# Altium project Sfarm.PrjPcb (part 1 of 2)
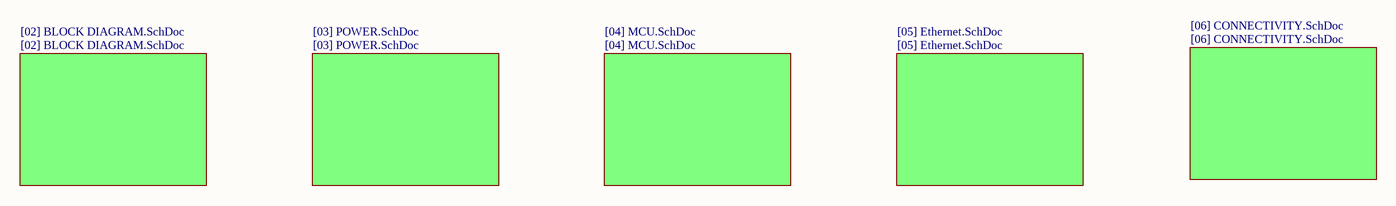
[diagram p0: SFarm.SchDoc]

6 sheets, 125 parts. Net scope: flat (ports and power ports of the same name join across sheets).
Board file: SFarmGW.PcbDoc
Sheets:
  SFarm.SchDoc
    [02] BLOCK DIAGRAM.SchDoc = [02] BLOCK DIAGRAM.SchDoc
    [03] POWER.SchDoc = [03] POWER.SchDoc
    [04] MCU.SchDoc = [04] MCU.SchDoc
    [05] Ethernet.SchDoc = [05] Ethernet.SchDoc
    [06] CONNECTIVITY.SchDoc = [06] CONNECTIVITY.SchDoc

## Sheet SFarm.SchDoc
size A3; Organization: Altium Limited; Address1: L3, 12a Rodborough Rd; Address2: Frenchs Forest; Address3: NSW; Address4: Australia 2086

### Sub-sheets
[02] BLOCK DIAGRAM.SchDoc = [02] BLOCK DIAGRAM.SchDoc: no entries
[03] POWER.SchDoc = [03] POWER.SchDoc: no entries
[04] MCU.SchDoc = [04] MCU.SchDoc: no entries
[05] Ethernet.SchDoc = [05] Ethernet.SchDoc: no entries
[06] CONNECTIVITY.SchDoc = [06] CONNECTIVITY.SchDoc: no entries

## Sheet [02] BLOCK DIAGRAM.SchDoc
size A3; Organization: Altium Limited; Address1: L3, 12a Rodborough Rd; Address2: Frenchs Forest; Address3: NSW; Address4: Australia 2086
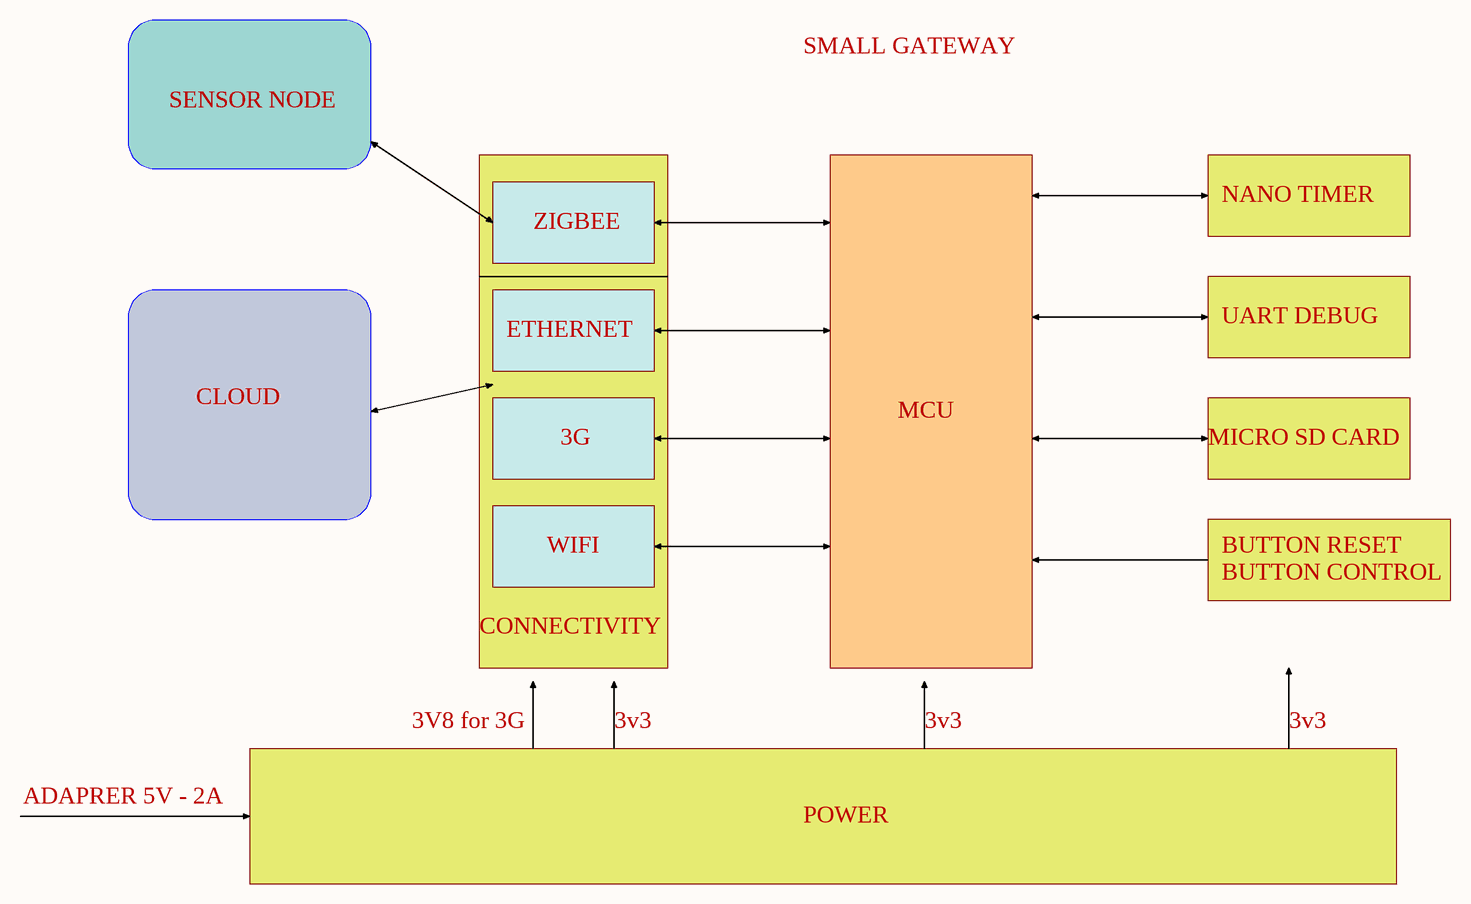
[diagram p1: [02] BLOCK DIAGRAM.SchDoc]

### Notes on the sheet
- SMALL GATEWAY
- SENSOR NODE
- NANO TIMER
- ZIGBEE
- ETHERNET
- UART DEBUG
- CLOUD
- MCU
- 3G
- MICRO SD CARD
- WIFI
- BUTTON RESET
- BUTTON CONTROL
- CONNECTIVITY
- 3V8 for 3G
- 3v3
- ADAPRER 5V - 2A
- POWER

## Sheet [03] POWER.SchDoc
size A3; Organization: Altium Limited; Address1: L3, 12a Rodborough Rd; Address2: Frenchs Forest; Address3: NSW; Address4: Australia 2086
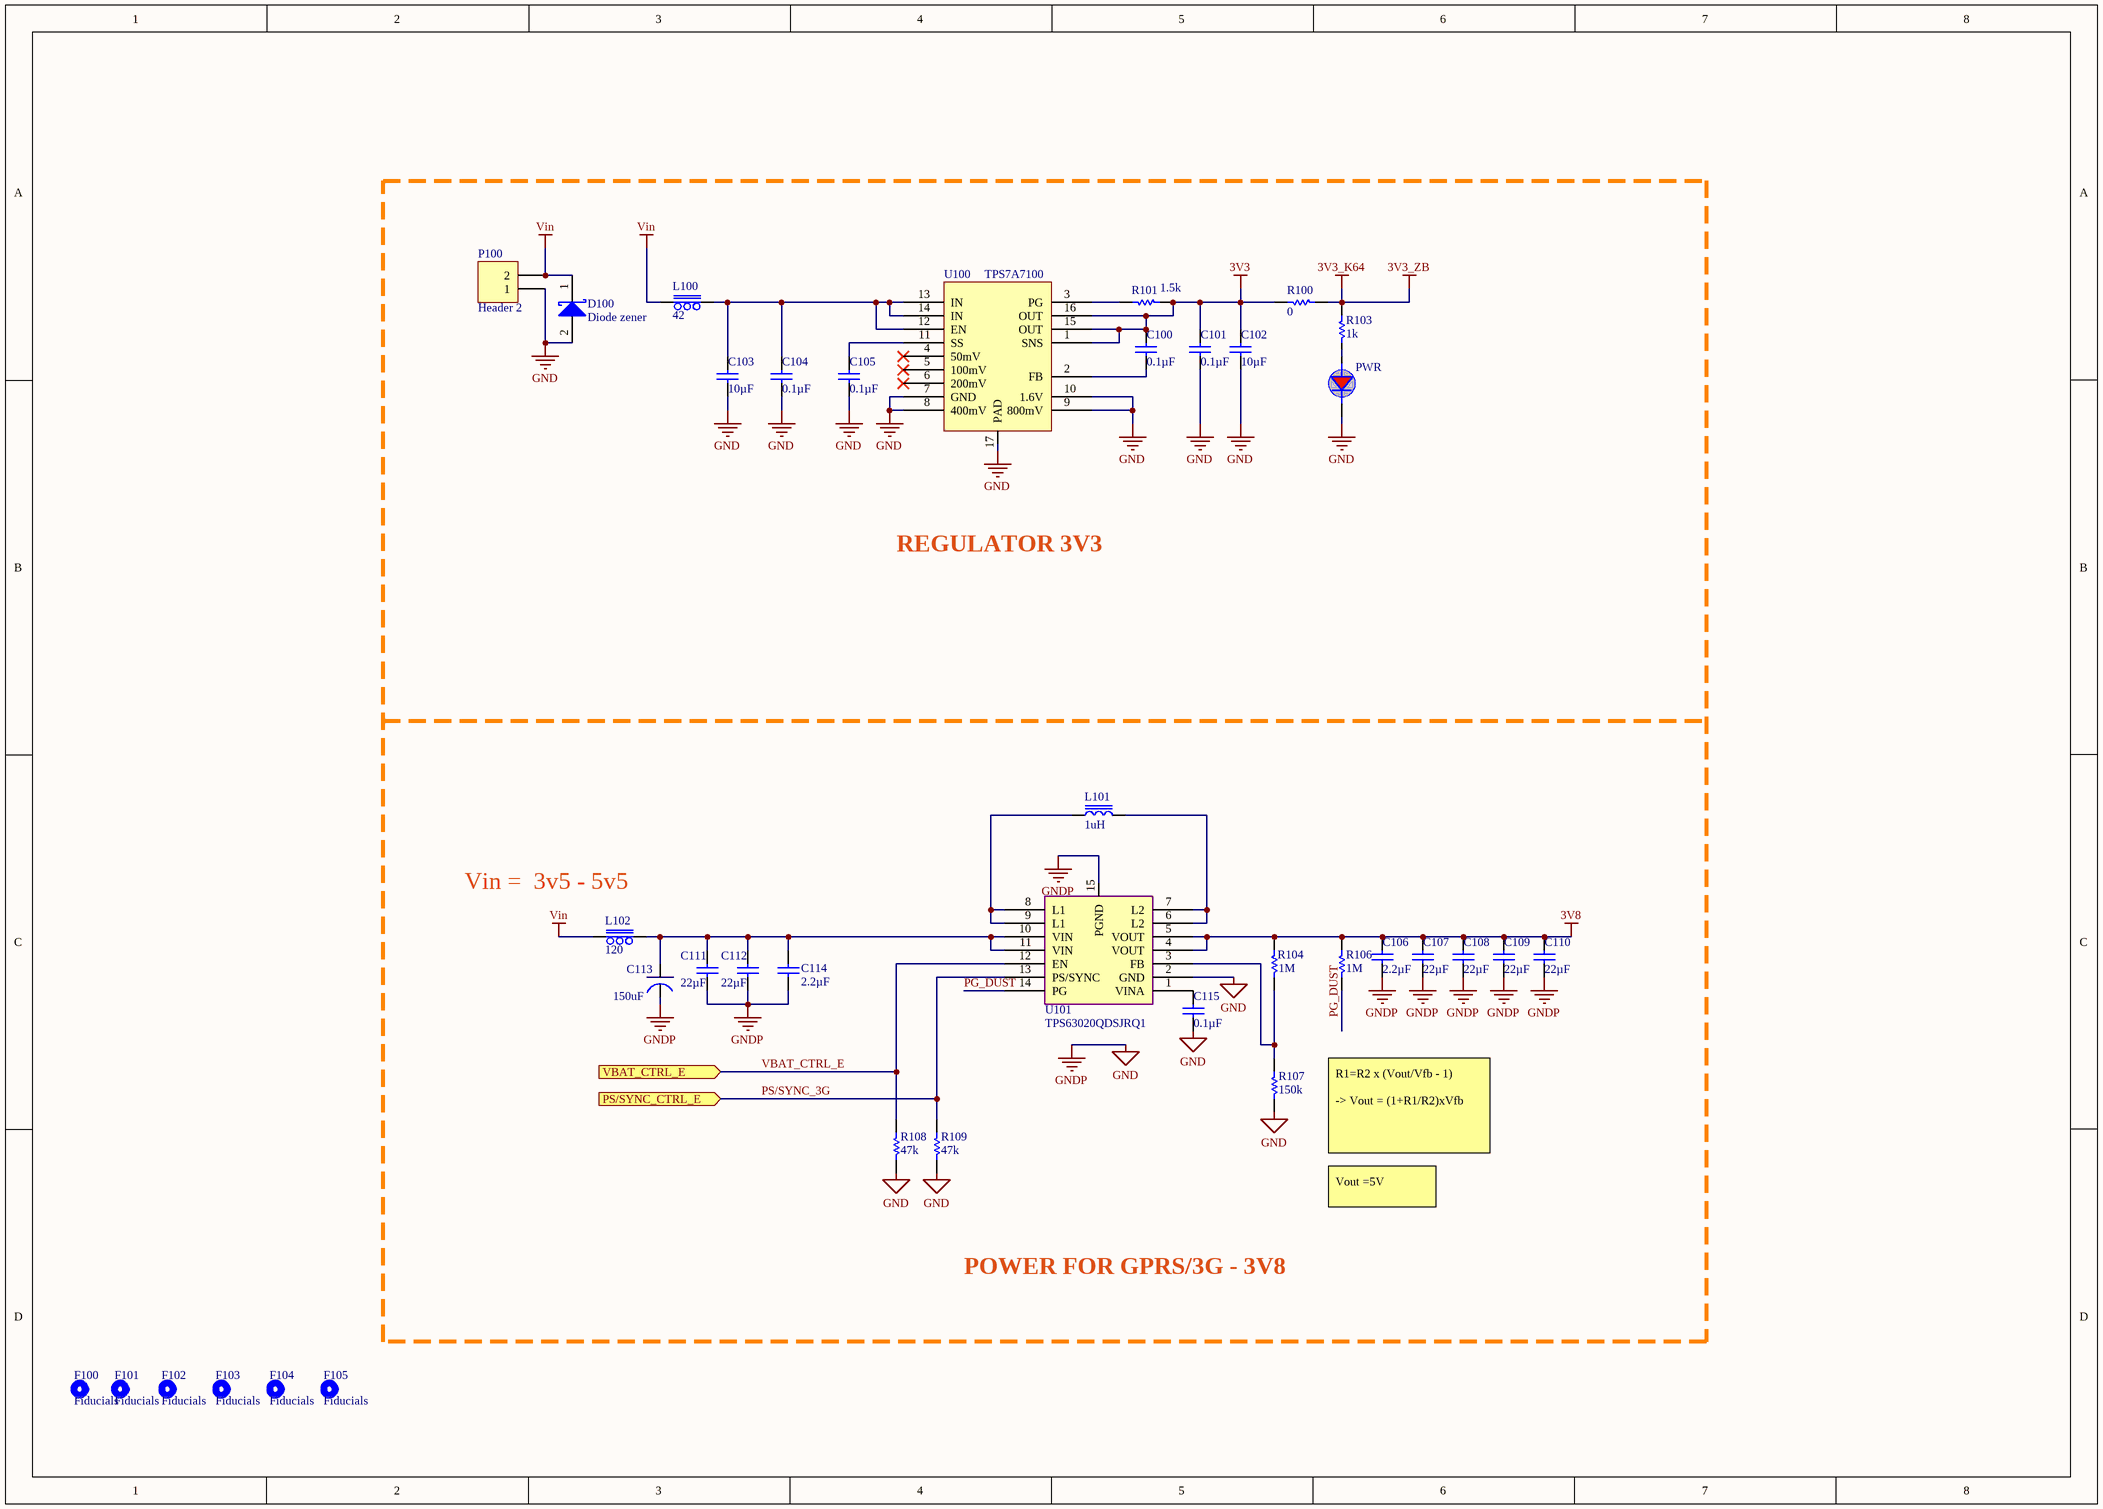
[diagram p2: [03] POWER.SchDoc]

### Parts
C100  0.1µF  [0402C]
C101  0.1µF  [0402C]
C102  10µF  [0805 cap]
C103  10µF  [0805 cap]
C104  0.1µF  [0402C]
C105  0.1µF  [0402C]
C106  2.2µF  [0402C]
C107  22µF  [0805 cap]
C108  22µF  [0805 cap]
C109  22µF  [0805 cap]
C110  22µF  [0805 cap]
C111  22µF  [0805 cap]
C112  22µF  [0805 cap]
C113  150uF  [CAPD7343]
C114  2.2µF  [0402C]
C115  0.1µF  [0402C]
D100  Diode zener  [SMA-diode]
F100  Fiducials  [fiducials]
F101  Fiducials  [fiducials]
F102  Fiducials  [fiducials]
F103  Fiducials  [fiducials]
F104  Fiducials  [fiducials]
F105  Fiducials  [fiducials]
L100  42  [0805F]
L101  1uH  [INDC4040X20N]
L102  120  [0805F]
P100  Header 2  [HED2]
PWR  (no value)  [0603LED-RED]
R100  0  [0805 Resistor]
R101  1.5k  [0603R]
R103  1k  [0603R]
R104  1M  [0402R]
R106  1M  [0603R]
R107  150k  [0402R]
R108  47k  [0603R]
R109  47k  [0603R]
U100  TPS7A7100  [QFN16]
U101  TPS63020QDSJRQ1  [VSON14]

### Ports
PS/SYNC_CTRL_E (in), VBAT_CTRL_E (in)

### Nets
3V3: C100.2 C101.2 C102.2 R100.1 R101.2 U100.1(SNS) U100.15(OUT) U100.16(OUT)
3V3_K64: R100.2 R103.2  [also labelled 3V3_ZB]
3V8: C106.2 C107.2 C108.2 C109.2 C110.2 R104.2 R106.2 U101.4(VOUT) U101.5(VOUT)
GND: C101.1 C102.1 C103.1 C104.1 C105.1 C106.1 C107.1 C108.1 C109.1 C110.1 C111.1 C112.1 C113.2 C114.1 C115.1 D100.2(A) P100.1 PWR.2(Katot) R107.1 R108.1 R109.1 U100.7(GND) U100.8(400mV) U100.9(800mV) U100.10(1.6V) U100.17(PAD) U101.2(GND) U101.15(PGND)  [also labelled GNDP]
Vin: D100.1(K) L100.1 L102.1 P100.2
PG_DUST: R106.1 U101.14(PG)
PS/SYNC_3G: R109.2 U101.13(PS/SYNC) ; port PS/SYNC_CTRL_E
VBAT_CTRL_E: R108.2 U101.12(EN) ; port VBAT_CTRL_E
NetC100_1: C100.1 U100.2(FB)
NetC103_2: C103.2 C104.2 L100.2 U100.12(EN) U100.13(IN) U100.14(IN)
NetC105_2: C105.2 U100.11(SS)
NetC111_2: C111.2 C112.2 C113.1 C114.2 L102.2 U101.10(VIN) U101.11(VIN)
NetC115_2: C115.2 U101.1(VINA)
NetL101_1: L101.1 U101.8(L1) U101.9(L1)
NetL101_2: L101.2 U101.6(L2) U101.7(L2)
NetPWR_1: PWR.1(anot) R103.1
NetR101_1: R101.1 U100.3(PG)
NetR104_1: R104.1 R107.2 U101.3(FB)

Not connected (* = marked no-connect by the designer): U100 4(50mV)* 5(100mV)* 6(200mV)*

### Notes on the sheet
- REGULATOR 3V3
- (near L102) Vin =  3v5 - 5v5
- R1=R2 x (Vout/Vfb - 1)
  -> Vout = (1+R1/R2)xVfb
- Vout =5V
- POWER FOR GPRS/3G - 3V8

### Library data of the parts
C100 C101 C104 C105 C115 = CAP0.1u0402: CAP CER 0.1UF 10V X7R 0402; Manufacturer: Taiyo Yuden; Manufacturer Part Number: LMK105B7104KVHF; Tolerance: ±10%; Supplier 1: Digi-Key; RoHS: RoHS Compliant; Category: Capacitors; Stock 1: 23930; Pricing 1: 1=0.1, 10=0.05, 100=0.0223, 500=0.01594, 1000=0.01252, 2500=0.01138, 5000=0.01047 (USD); Packaging: Cut Tape (CT); Part Status: Active; Capacitance: 0.1µF; Voltage - Rated: 10V; Temperature Coefficient: X7R; Operating Temperature: -55°C ~ 125°C; Features: -; Ratings: AEC-Q200; Applications: Automotive; Mounting Type: Surface Mount, MLCC; Package / Case: 0402 (1005 Metric); Size / Dimension: 0.039" L x 0.020" W (1.00mm x 0.50mm); Height - Seated (Max): -; Thickness (Max): 0.022" (0.55mm); Lead Spacing: -; Lead Style: -; ComponentLink1URL: http://www.yuden.co.jp/productdata/catalog/en/mlcc_all_hq_e.pdf; ComponentLink1Description: http://www.yuden.co.jp/productdata/catalog/en/mlcc_all_hq_e.pdf; Supplier Part Number 1: 587-3769-1-ND
C102 C103 = cap10u0805: CAP CER 10UF 16V X7R 0805; Manufacturer: Taiyo Yuden; Manufacturer Part Number: EMK212BB7106MG-T; Tolerance: ±20%; Supplier 1: Digi-Key; RoHS: RoHS Compliant; Category: Capacitors; Stock 1: 221600; Pricing 1: 1=0.51, 10=0.351, 100=0.2106, 500=0.15798, 1000=0.1334 (USD); Packaging: Cut Tape (CT); Part Status: Active; Capacitance: 10µF; Voltage - Rated: 16V; Temperature Coefficient: X7R; Operating Temperature: -55°C ~ 125°C; Features: -; Ratings: -; Applications: General Purpose; Mounting Type: Surface Mount, MLCC; Package / Case: 0805 (2012 Metric); Size / Dimension: 0.079" L x 0.049" W (2.00mm x 1.25mm); Height - Seated (Max): -; Thickness (Max): 0.053" (1.35mm); Lead Spacing: -; Lead Style: -; ComponentLink1URL: http://www.yuden.co.jp/productdata/catalog/en/mlcc06_e.pdf; ComponentLink1Description: http://www.yuden.co.jp/productdata/catalog/en/mlcc06_e.pdf; Supplier Part Number 1: 587-3319-1-ND
C106 C114 = cap2.2u0402: CAP CER 2.2UF 16V X5R 0402; Manufacturer: Taiyo Yuden; Manufacturer Part Number: EMK105ABJ225MV-F; Tolerance: ±20%; Supplier 1: Digi-Key; RoHS: RoHS Compliant; Category: Capacitors; Stock 1: 43595; Pricing 1: 1=0.27, 10=0.187, 100=0.1062, 500=0.07498, 1000=0.0656, 2500=0.06248, 5000=0.05779 (USD); Packaging: Cut Tape (CT); Part Status: Active; Capacitance: 2.2µF; Voltage - Rated: 16V; Temperature Coefficient: X5R; Operating Temperature: -55°C ~ 85°C; Features: -; Ratings: -; Applications: General Purpose; Mounting Type: Surface Mount, MLCC; Package / Case: 0402 (1005 Metric); Size / Dimension: 0.039" L x 0.020" W (1.00mm x 0.50mm); Height - Seated (Max): -; Thickness (Max): 0.022" (0.55mm); Lead Spacing: -; Lead Style: -; ComponentLink1URL: http://ds.yuden.co.jp/TYCOMPAS/ut/detail.do?productNo=EMK105ABJ225MV-F&fileName=EMK105ABJ225MV-F_SS&mode=specSheetDownload; ComponentLink1Description: http://ds.yuden.co.jp/TYCOMPAS/ut/detail.do?productNo=EMK105ABJ225MV-F&fileName=EMK105ABJ225MV-F_SS&mode=specSheetDownload; Supplier Part Number 1: 587-3302-1-ND
C107-C112 = cap22u0805: CAP CER 22UF 16V X5R 0805; Manufacturer: Taiyo Yuden; Manufacturer Part Number: EMK212BBJ226MG-T; Tolerance: ±20%; Supplier 1: Digi-Key; RoHS: RoHS Compliant; Category: Capacitors; Stock 1: 427128; Pricing 1: 1=0.55, 10=0.389, 100=0.2562, 500=0.18976, 1000=0.16129 (USD); Packaging: Cut Tape (CT); Part Status: Active; Capacitance: 22µF; Voltage - Rated: 16V; Temperature Coefficient: X5R; Operating Temperature: -55°C ~ 85°C; Features: -; Ratings: -; Applications: General Purpose; Mounting Type: Surface Mount, MLCC; Package / Case: 0805 (2012 Metric); Size / Dimension: 0.079" L x 0.039" W (2.00mm x 1.00mm); Height - Seated (Max): -; Thickness (Max): 0.049" (1.25mm); Lead Spacing: -; Lead Style: -; ComponentLink1URL: http://ds.yuden.co.jp/TYCOMPAS/ut/detail.do?productNo=EMK212BBJ226MG-T&fileName=EMK212BBJ226MG-T_SS&mode=specSheetDownload; ComponentLink1Description: http://ds.yuden.co.jp/TYCOMPAS/ut/detail.do?productNo=EMK212BBJ226MG-T&fileName=EMK212BBJ226MG-T_SS&mode=specSheetDownload; Supplier Part Number 1: 587-3239-1-ND
C113 = CAPTan150u7343: CAP TANT 150UF 10V 10% 2917; Manufacturer: AVX Corporation; Manufacturer Part Number: TPSD157K010R0085; Manufacturer Size Code: D; Type: Molded; ESR (Equivalent Series Resistance): 85 mOhm; Supplier 1: Digi-Key; Supplier Part Number 1: 478-9158-1-ND; RoHS: RoHS Compliant; Category: Capacitors; Stock 1: 1344; Pricing 1: 1=1.8, 10=1.419, 100=1.0639 (USD); Packaging: Cut Tape (CT); Part Status: Active; Tolerance: ±10%; Operating Temperature: -55°C ~ 125°C; Lifetime @ Temp.: -; Mounting Type: Surface Mount; Package / Case: 2917 (7343 Metric); Size / Dimension: 0.287" L x 0.169" W (7.30mm x 4.30mm); Height - Seated (Max): 0.122" (3.10mm); Lead Spacing: -; Features: General Purpose; Failure Rate: -; ComponentLink1URL: http://datasheets.avx.com/TPS.pdf; ComponentLink1Description: http://datasheets.avx.com/TPS.pdf
L100 = Ferrite Bead: FERRITE BEAD 42 OHM 0805 1LN; Manufacturer: Taiyo Yuden; Manufacturer Part Number: FBMJ2125HS420-TV; Filter Type: Power Line; Number of Lines: 1; Impedance @ Frequency: 42 Ohm @ 100MHz; Current Rating (Max): 4A; DC Resistance (DCR) (Max): 8 mOhm; Supplier 1: Digi-Key; Supplier Part Number 1: 587-3851-6-ND; RoHS: RoHS Compliant; Category: Filters; Stock 1: 2013; Pricing 1: 1=0.2, 10=0.154, 25=0.1276, 50=0.11, 100=0.099, 250=0.0836, 500=0.0748, 1000=0.0638 (USD); Packaging: Digi-Reel®; Part Status: Active; Ratings: AEC-Q200; Operating Temperature: -40°C ~ 125°C; Package / Case: 0805 (2012 Metric); Mounting Type: Surface Mount; Height (Max): 0.041" (1.05mm); Size / Dimension: 0.079" L x 0.049" W (2.00mm x 1.25mm); ComponentLink1URL: http://ds.yuden.co.jp/TYCOMPAS/ut/detail.do?productNo=FBMJ2125HS420-TV&fileName=FBMJ2125HS420-TV_SS&mode=specSheetDownload; ComponentLink1Description: http://ds.yuden.co.jp/TYCOMPAS/ut/detail.do?productNo=FBMJ2125HS420-TV&fileName=FBMJ2125HS420-TV_SS&mode=specSheetDownload
L101 = Inductor: Fixed Inductors XFL4020 Low DCR Ind 1 uH 20% 11 A Compos; Manufacturer: Coilcraft; Manufacturer Part Number: XFL4020-102MEB; Part # Aliases: XFL4020-102MEC; Case Height: 2.1 mm; Case Length: 4.3 mm; Core Material: Composite; Maximum DC Current: 11 A; Maximum DC Resistance: 11.9 mOhms; Self Resonant Frequency: 64 MHz; Shielding: Shielded; Test Frequency: 100 kHz; Supplier 1: Mouser; Supplier Part Number 1: 994-XFL4020-102MEB; Inductance: 1 uH; Dimensions: 4.3 mm W x 4.3 mm L x 2.1 mm H; Case Width: 4.3 mm; RoHS: Details; Operating Temperature Range: - 40 C to + 125 C; Packaging: Cut Tape; Product: Power Inductors; Tolerance: 20 %; Termination Style: SMD/SMT; Series: XFL4020; ComponentLink1URL: https://datasheet.ciiva.com/13167/xfl4020-13167357.pdf; ComponentLink1Description: https://datasheet.ciiva.com/13167/xfl4020-13167357.pdf
L102 = Ferrite Bead: Manufacturer: MURATA; Manufacturer Part Number: BLM18PG121SN1D; Ferrite Case Style: 0603 [1608 Metric]; Product Range: BLM18; DC Current Rating: 2; DC Resistance Max: 0.05; Impedance Tolerance: 25%; Supplier 1: Newark; RoHS: YES; Stock 1: 28827; Pricing 1: 1=0.039, 50=0.036, 100=0.029, 500=0.026, 1000=0.023, 2500=0.022, 5000=0.02, 10000=0.019 (USD); Automotive Qualifications Standard: -; Packaging: Each; ComponentLink1URL: http://www.farnell.com/datasheets/1740433.pdf; ComponentLink1Description: http://www.farnell.com/datasheets/1740433.pdf; ComponentLink2URL: http://www.farnell.com/datasheets/5148.pdf; ComponentLink2Description: http://www.farnell.com/datasheets/5148.pdf; Supplier Part Number 1: 73M9109
P100 = Header 2: Header, 2-Pin; LatestRevisionDate: 17-Jul-2002; LatestRevisionNote: Re-released for DXP Platform.; Publisher: Altium Limited
PWR = LedRed0603: LED RED CLEAR 0603 SMD; Manufacturer: Everlight Electronics Co Ltd; Manufacturer Part Number: QTLP600C7TR; Lens Color: Colorless; Millicandela Rating: 20mcd; Lens Style/Size: Rectangle with Flat Top, 1.20mm x 0.80mm; Voltage - Forward (Vf) (Typ): 1.9V; Current - Test: 20mA; Viewing Angle: 100°; Wavelength - Dominant: 645nm; Wavelength - Peak: 660nm; Supplier 1: Digi-Key; RoHS: RoHS Compliant; Category: Optoelectronics; Stock 1: 19325; Pricing 1: 1=0.41, 10=0.297, 25=0.2276, 100=0.1485, 250=0.10892, 500=0.0924, 1000=0.0759 (USD); Packaging: Cut Tape (CT); Part Status: Active; Color: Red; Lens Transparency: Clear; Mounting Type: Surface Mount; Features: -; Package / Case: 0603 (1608 Metric); Size / Dimension: 1.60mm L x 0.80mm W; Height (Max): 0.80mm; ComponentLink1URL: http://media.digikey.com/pdf/Data%20Sheets/Everlight%20PDFs/QTLP600C.pdf; ComponentLink1Description: http://media.digikey.com/pdf/Data%20Sheets/Everlight%20PDFs/QTLP600C.pdf; Supplier Part Number 1: 1080-1400-1-ND
R100 = RES00805: RES SMD 0.0 OHM JUMPER 1/8W 0805; Manufacturer: Panasonic Electronic Components; Manufacturer Part Number: ERJ-6GEY0R00V; Resistance (Ohms): 0.0; Power (Watts): 0.125W, 1/8W; Supplier 1: Digi-Key; RoHS: RoHS Compliant; Category: Resistors; Stock 1: 562130; Pricing 1: 1=0.1, 10=0.024, 25=0.0172, 50=0.0132, 100=0.0097, 250=0.00744, 500=0.00594, 1000=0.00437 (USD); Packaging: Cut Tape (CT); Part Status: Active; Tolerance: Jumper; Composition: Thick Film; Features: Automotive AEC-Q200; Temperature Coefficient: -; Operating Temperature: -55°C ~ 155°C; Package / Case: 0805 (2012 Metric); Supplier Device Package: 0805; Size / Dimension: 0.079" L x 0.049" W (2.00mm x 1.25mm); Height - Seated (Max): 0.028" (0.70mm); Failure Rate: -; ComponentLink1URL: http://industrial.panasonic.com/www-cgi/jvcr13pz.cgi?E+PZ+3+AOA0001+ERJ6GEY0R00V+7+WW; ComponentLink1Description: http://industrial.panasonic.com/www-cgi/jvcr13pz.cgi?E+PZ+3+AOA0001+ERJ6GEY0R00V+7+WW; Supplier Part Number 1: P0.0ACT-ND
R101 = RES1k50603: RES SMD 1.5K OHM 1% 1/10W 0603; Manufacturer: Panasonic Electronic Components; Manufacturer Part Number: ERJ-3EKF1501V; Power (Watts): 0.1W, 1/10W; Temperature Coefficient: ±100ppm/°C; Supplier 1: Digi-Key; RoHS: RoHS Compliant; Category: Resistors; Stock 1: 0; Pricing 1: 1=0.1, 10=0.021, 100=0.0087, 1000=0.00389, 2500=0.00338 (USD); Packaging: Cut Tape (CT); Part Status: Active; Resistance (Ohms): 1.5k; Tolerance: ±1%; Composition: Thick Film; Features: Automotive AEC-Q200; Operating Temperature: -55°C ~ 155°C; Package / Case: 0603 (1608 Metric); Supplier Device Package: 0603; Size / Dimension: 0.063" L x 0.031" W (1.60mm x 0.80mm); Height - Seated (Max): 0.022" (0.55mm); Failure Rate: -; ComponentLink1URL: https://industrial.panasonic.com/cdbs/www-data/pdf/RDA0000/AOA0000C298.pdf; ComponentLink1Description: https://industrial.panasonic.com/cdbs/www-data/pdf/RDA0000/AOA0000C298.pdf; Supplier Part Number 1: P1.50KHCT-ND
R103 = RES1k0603: RES SMD 1K OHM 1% 1/10W 0603; Manufacturer: Panasonic Electronic Components; Manufacturer Part Number: ERJ-3EKF1001V; Power (Watts): 0.1W, 1/10W; Temperature Coefficient: ±100ppm/°C; Supplier 1: Digi-Key; RoHS: RoHS Compliant; Category: Resistors; Stock 1: 0; Pricing 1: 1=0.1, 10=0.021, 100=0.0087, 1000=0.00389, 2500=0.00338 (USD); Packaging: Digi-Reel®; Part Status: Active; Resistance (Ohms): 1k; Tolerance: ±1%; Composition: Thick Film; Features: Automotive AEC-Q200; Operating Temperature: -55°C ~ 155°C; Package / Case: 0603 (1608 Metric); Supplier Device Package: 0603; Size / Dimension: 0.063" L x 0.031" W (1.60mm x 0.80mm); Height - Seated (Max): 0.022" (0.55mm); Failure Rate: -; ComponentLink1URL: https://industrial.panasonic.com/cdbs/www-data/pdf/RDA0000/AOA0000C298.pdf; ComponentLink1Description: https://industrial.panasonic.com/cdbs/www-data/pdf/RDA0000/AOA0000C298.pdf; Supplier Part Number 1: P1.00KHDKR-ND
R104 = RES1M0402: RES SMD 1M OHM 1% 1/10W 0402; Manufacturer: Panasonic Electronic Components; Manufacturer Part Number: ERJ-2RKF1004X; Power (Watts): 0.1W, 1/10W; Temperature Coefficient: ±100ppm/°C; Supplier 1: Digi-Key; RoHS: RoHS Compliant; Category: Resistors; Stock 1: 0; Pricing 1: 1=0.1, 10=0.028, 100=0.0113, 1000=0.00509, 2500=0.00442, 5000=0.00365 (USD); Packaging: Cut Tape (CT); Part Status: Active; Resistance (Ohms): 1M; Tolerance: ±1%; Composition: Thick Film; Features: Automotive AEC-Q200; Operating Temperature: -55°C ~ 155°C; Package / Case: 0402 (1005 Metric); Supplier Device Package: 0402; Size / Dimension: 0.039" L x 0.020" W (1.00mm x 0.50mm); Height - Seated (Max): 0.016" (0.40mm); Failure Rate: -; ComponentLink1URL: https://industrial.panasonic.com/cdbs/www-data/pdf/RDA0000/AOA0000C298.pdf; ComponentLink1Description: https://industrial.panasonic.com/cdbs/www-data/pdf/RDA0000/AOA0000C298.pdf; Supplier Part Number 1: P1.00MLCT-ND
R106 = RES1M0603: RES SMD 1M OHM 1% 1/10W 0603; Manufacturer: Panasonic Electronic Components; Manufacturer Part Number: ERJ-3EKF1004V; Power (Watts): 0.1W, 1/10W; Temperature Coefficient: ±100ppm/°C; Supplier 1: Digi-Key; RoHS: RoHS Compliant; Category: Resistors; Stock 1: 0; Pricing 1: 1=0.1, 10=0.021, 100=0.0087, 1000=0.00389, 2500=0.00338 (USD); Packaging: Cut Tape (CT); Part Status: Active; Resistance (Ohms): 1M; Tolerance: ±1%; Composition: Thick Film; Features: Automotive AEC-Q200; Operating Temperature: -55°C ~ 155°C; Package / Case: 0603 (1608 Metric); Supplier Device Package: 0603; Size / Dimension: 0.063" L x 0.031" W (1.60mm x 0.80mm); Height - Seated (Max): 0.022" (0.55mm); Failure Rate: -; ComponentLink1URL: https://industrial.panasonic.com/cdbs/www-data/pdf/RDA0000/AOA0000C298.pdf; ComponentLink1Description: https://industrial.panasonic.com/cdbs/www-data/pdf/RDA0000/AOA0000C298.pdf; Supplier Part Number 1: P1.00MHCT-ND
R107 = Resistor: RES SMD 150K OHM 1% 1/10W 0402; Manufacturer: Panasonic Electronic Components; Manufacturer Part Number: ERJ-2RKF1503X; Power (Watts): 0.1W, 1/10W; Temperature Coefficient: ±100ppm/°C; Supplier 1: Digi-Key; Supplier Part Number 1: P150KLCT-ND; RoHS: RoHS Compliant; Category: Resistors; Stock 1: 0; Pricing 1: 1=0.1, 10=0.028, 100=0.0113, 1000=0.00509, 2500=0.00442, 5000=0.00365 (USD); Packaging: Cut Tape (CT); Part Status: Active; Resistance (Ohms): 150k; Tolerance: ±1%; Composition: Thick Film; Features: Automotive AEC-Q200; Operating Temperature: -55°C ~ 155°C; Package / Case: 0402 (1005 Metric); Supplier Device Package: 0402; Size / Dimension: 0.039" L x 0.020" W (1.00mm x 0.50mm); Height - Seated (Max): 0.016" (0.40mm); Failure Rate: -; ComponentLink1URL: https://industrial.panasonic.com/cdbs/www-data/pdf/RDA0000/AOA0000C298.pdf; ComponentLink1Description: https://industrial.panasonic.com/cdbs/www-data/pdf/RDA0000/AOA0000C298.pdf
R108 R109 = RES47k0603: RES SMD 47K OHM 1% 1/10W 0603; Manufacturer: Panasonic Electronic Components; Manufacturer Part Number: ERJ-3EKF4702V; Power (Watts): 0.1W, 1/10W; Temperature Coefficient: ±100ppm/°C; Supplier 1: Digi-Key; RoHS: RoHS Compliant; Category: Resistors; Stock 1: 2205285; Pricing 1: 1=0.1, 10=0.021, 100=0.0087, 1000=0.00389, 2500=0.00338 (USD); Packaging: Cut Tape (CT); Part Status: Active; Resistance (Ohms): 47k; Tolerance: ±1%; Composition: Thick Film; Features: Automotive AEC-Q200; Operating Temperature: -55°C ~ 155°C; Package / Case: 0603 (1608 Metric); Supplier Device Package: 0603; Size / Dimension: 0.063" L x 0.031" W (1.60mm x 0.80mm); Height - Seated (Max): 0.022" (0.55mm); Failure Rate: -; ComponentLink1URL: https://industrial.panasonic.com/cdbs/www-data/pdf/RDA0000/AOA0000C298.pdf; ComponentLink1Description: https://industrial.panasonic.com/cdbs/www-data/pdf/RDA0000/AOA0000C298.pdf; Supplier Part Number 1: P47.0KHCT-ND
U100 = TPS7A7100: IC REG LDO FIX/ADJ 1A 16QFN; Manufacturer: Texas Instruments; Manufacturer Part Number: TPS7A7100RGTR; Regulator Topology: Positive Fixed or Adjustable; Voltage - Output: 0.9 V ~ 5 V; Voltage - Input: 1.425 V ~ 6.5 V; Current - Limit (Min): 1.1A; Supplier 1: Digi-Key; RoHS: RoHS Compliant; Category: Integrated Circuits (ICs); Stock 1: 5133; Pricing 1: 1=2.19, 10=1.965, 100=1.5796, 500=1.2978, 1000=1.07532 (USD); Packaging: Cut Tape (CT); Part Status: Active; Current - Output: 1A; Voltage - Dropout (Typical): -; Operating Temperature: -40°C ~ 125°C; Mounting Type: Surface Mount; Package / Case: 16-VFQFN Exposed Pad; Supplier Device Package: 16-QFN (3x3); ComponentLink1URL: http://www.ti.com/lit/ds/symlink/tps7a7100.pdf; ComponentLink1Description: http://www.ti.com/lit/ds/symlink/tps7a7100.pdf; Supplier Part Number 1: 296-40978-1-ND
U101 = TPS63020: IC REG BUCK BST ADJ 3.5A; Manufacturer: Texas Instruments; Function: Step-Up/Step-Down; Output Configuration: Positive; Topology: Buck-Boost; Output Type: Adjustable; Number of Outputs: 1; Voltage - Input (Min): 1.8V; Voltage - Input (Max): 5.5V; Voltage - Output (Min/Fixed): 1.2V; Current - Output: 3.5A (Switch); Frequency - Switching: 2.4MHz; Synchronous Rectifier: Yes; Supplier 1: Digi-Key; Manufacturer Part Number: TPS63020QDSJRQ1; RoHS: RoHS Compliant; Category: Integrated Circuits (ICs); Stock 1: 3331; Pricing 1: 1=3.33, 10=2.993, 100=2.4524, 500=2.08766, 1000=1.76068 (USD); Packaging: Cut Tape (CT); Part Status: Active; Voltage - Output (Max): 5.5V; Operating Temperature: -40°C ~ 125°C (TJ); Mounting Type: Surface Mount; Package / Case: 14-VFDFN Exposed Pad; Supplier Device Package: 14-VSON (4x3); ComponentLink1URL: http://www.ti.com/lit/ds/symlink/tps63020-q1.pdf; ComponentLink1Description: http://www.ti.com/lit/ds/symlink/tps63020-q1.pdf; Supplier Part Number 1: 296-43286-1-ND

## Sheet [04] MCU.SchDoc
size A3; Organization: Altium Limited; Address1: L3, 12a Rodborough Rd; Address2: Frenchs Forest; Address3: NSW; Address4: Australia 2086
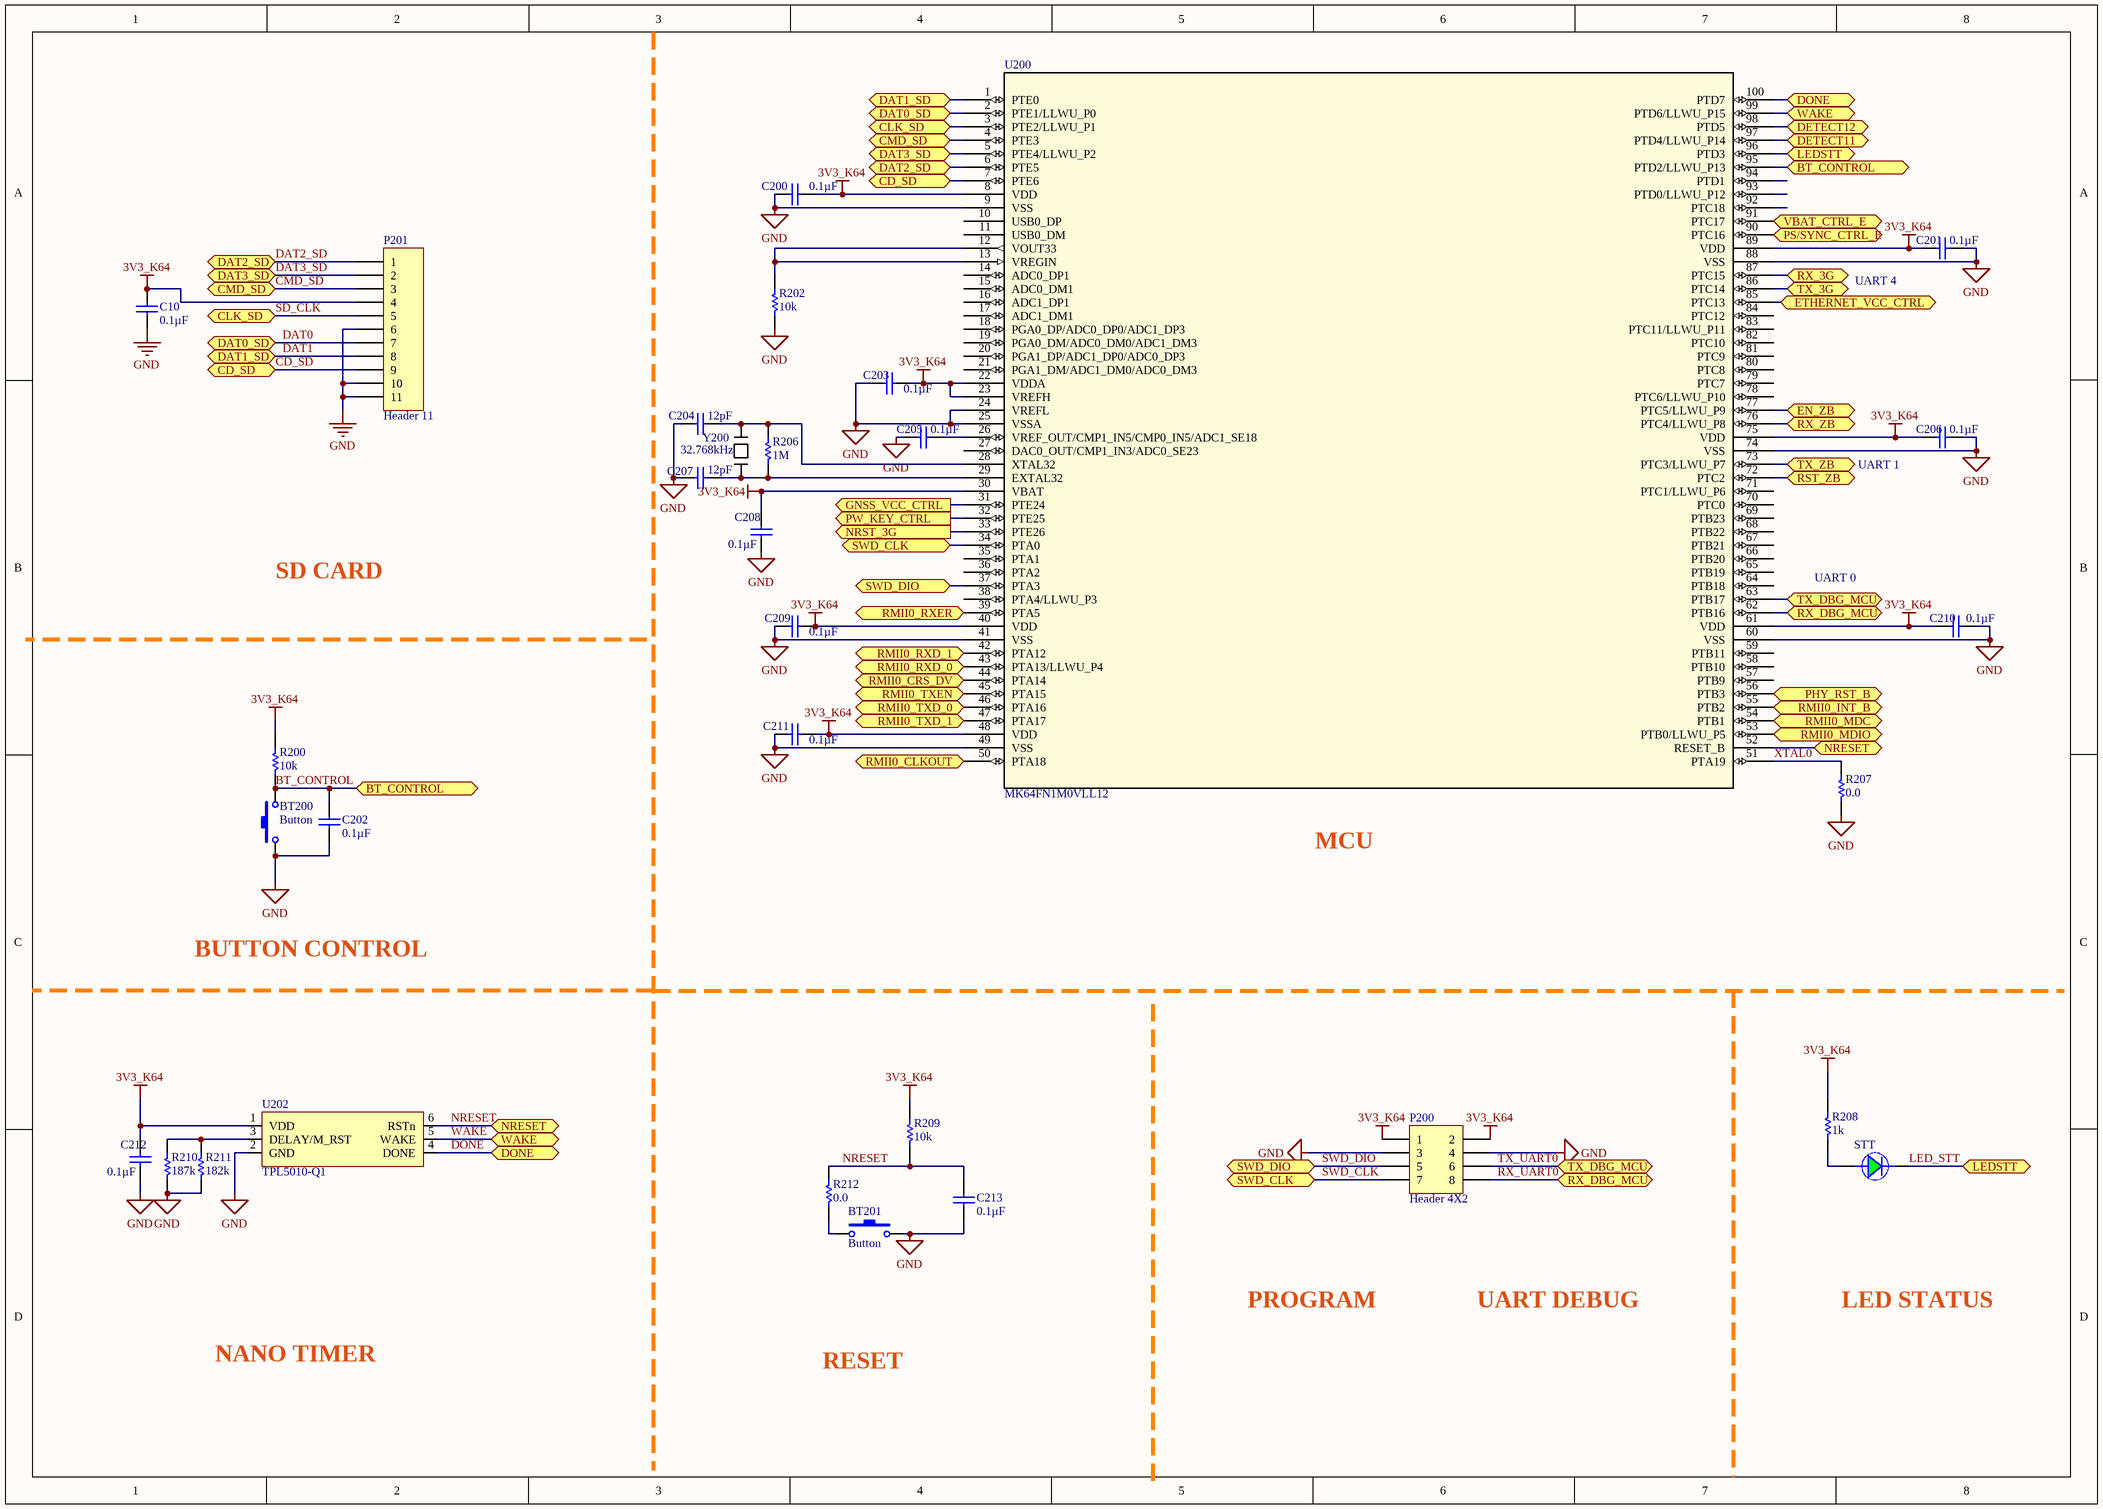
[diagram p3: [04] MCU.SchDoc]

### Parts
BT200  Button  [SWSMD]
BT201  Button  [SWSMD]
C10  0.1µF  [0402C]
C200  0.1µF  [0402C]
C201  0.1µF  [0402C]
C202  0.1µF  [0402C]
C203  0.1µF  [0402C]
C204  12pF  [0402C]
C205  0.1µF  [0402C]
C206  0.1µF  [0402C]
C207  12pF  [0402C]
C208  0.1µF  [0402C]
C209  0.1µF  [0402C]
C210  0.1µF  [0402C]
C211  0.1µF  [0402C]
C212  0.1µF  [0402C]
C213  0.1µF  [0402C]
P200  Header 4X2  [HDR2X4]
P201  Header 11  [TF_V3]
R200  10k  [0603R]
R202  10k  [0603R]
R206  1M  [0603R]
R207  0.0  [0603R]
R208  1k  [0603R]
R209  10k  [0603R]
R210  187k  [0603R]
R211  182k  [0603R]
R212  0.0  [0603R]
STT  (no value)  [0603LED-GREEN]
U200  MK64FN1M0VLL12  [LQFP-100_14X14X1]
U202  TPL5010-Q1  [SOT23-6]
Y200  32.768kHz  [ABS07-crystal]

### Ports
BT_CONTROL (bidir), CD_SD, CLK_SD, CMD_SD, DAT0_SD, DAT1_SD, DAT2_SD, DAT3_SD, DETECT11, DETECT12, DONE, EN_ZB, ETHERNET_VCC_CTRL (bidir), GNSS_VCC_CTRL (out), LEDSTT, NRESET, NRST_3G (out), PHY_RST_B (bidir), PS/SYNC_CTRL_E (out), PW_KEY_CTRL (out), RMII0_CLKOUT (bidir), RMII0_CRS_DV (bidir), RMII0_INT_B (bidir), RMII0_MDC (bidir), RMII0_MDIO (bidir), RMII0_RXD_0 (bidir), RMII0_RXD_1 (bidir), RMII0_RXER (bidir), RMII0_TXD_0 (bidir), RMII0_TXD_1 (bidir), RMII0_TXEN (bidir), RST_ZB, RX_3G, RX_DBG_MCU, RX_ZB, SWD_CLK, SWD_DIO, TX_3G, TX_DBG_MCU, TX_ZB, VBAT_CTRL_E (out), WAKE

### Nets
3V3_K64: C10.1 C200.1 C201.1 C203.1 C206.1 C208.1 C209.2 C210.1 C211.2 C212.2 P200.1 P200.2 P201.4 R200.1 R208.2 R209.1 U200.8(VDD) U200.22(VDDA) U200.23(VREFH) U200.30(VBAT) U200.40(VDD) U200.48(VDD) U200.61(VDD) U200.75(VDD) U200.89(VDD) U202.1(VDD)
GND: BT200.1 BT201.2 C10.2 C200.2 C201.2 C202.1 C203.2 C204.1 C205.2 C206.2 C207.1 C208.2 C209.1 C210.2 C211.1 C212.1 C213.1 P200.3 P200.4 P201.6 P201.10 P201.11 R202.1 R207.1 R210.1 R211.1 U200.9(VSS) U200.24(VREFL) U200.25(VSSA) U200.41(VSS) U200.49(VSS) U200.60(VSS) U200.74(VSS) U200.88(VSS) U202.2(GND)
BT_CONTROL: BT200.2 C202.2 R200.2 U200.95(PTD2/LLWU_P13) ; port BT_CONTROL
CD_SD: P201.9 U200.7(PTE6) ; port CD_SD
CMD_SD: P201.3 U200.4(PTE3) ; port CMD_SD
DAT0: P201.7 U200.2(PTE1/LLWU_P0) ; port DAT0_SD
DAT1: P201.8 U200.1(PTE0) ; port DAT1_SD
DAT2_SD: P201.1 U200.6(PTE5) ; port DAT2_SD
DAT3_SD: P201.2 U200.5(PTE4/LLWU_P2) ; port DAT3_SD
DETECT11: U200.97(PTD4/LLWU_P14) ; port DETECT11
DETECT12: U200.98(PTD5) ; port DETECT12
DONE: U200.100(PTD7) U202.4(DONE) ; port DONE
EN_ZB: U200.77(PTC5/LLWU_P9) ; port EN_ZB
ETHERNET_VCC_CTRL: U200.85(PTC13) ; port ETHERNET_VCC_CTRL
GNSS_VCC_CTRL: U200.31(PTE24) ; port GNSS_VCC_CTRL
LED_STT: STT.2(Katot) U200.96(PTD3) ; port LEDSTT
NRESET: C213.2 R209.2 R212.2 U200.52(RESET_B) U202.6(RSTn) ; port NRESET
NRST_3G: U200.33(PTE26) ; port NRST_3G
PHY_RST_B: U200.56(PTB3) ; port PHY_RST_B
PS/SYNC_3G: U200.90(PTC16) ; port PS/SYNC_CTRL_E
PW_KEY_CTRL: U200.32(PTE25) ; port PW_KEY_CTRL
RMII0_CLKOUT: U200.50(PTA18) ; port RMII0_CLKOUT
RMII0_CRS_DV: U200.44(PTA14) ; port RMII0_CRS_DV
RMII0_INT_B: U200.55(PTB2) ; port RMII0_INT_B
RMII0_MDC: U200.54(PTB1) ; port RMII0_MDC
RMII0_MDIO: U200.53(PTB0/LLWU_P5) ; port RMII0_MDIO
RMII0_RXD_0: U200.43(PTA13/LLWU_P4) ; port RMII0_RXD_0
RMII0_RXD_1: U200.42(PTA12) ; port RMII0_RXD_1
RMII0_RXER: U200.39(PTA5) ; port RMII0_RXER
RMII0_TXD_0: U200.46(PTA16) ; port RMII0_TXD_0
RMII0_TXD_1: U200.47(PTA17) ; port RMII0_TXD_1
RMII0_TXEN: U200.45(PTA15) ; port RMII0_TXEN
RST_ZB: U200.72(PTC2) ; port RST_ZB
RX_3G: U200.87(PTC15) ; port RX_3G
RX_UART0: P200.8 U200.62(PTB16) ; port RX_DBG_MCU
RX_ZB: U200.76(PTC4/LLWU_P8) ; port RX_ZB
SD_CLK: P201.5 U200.3(PTE2/LLWU_P1) ; port CLK_SD
SWD_CLK: P200.7 U200.34(PTA0) ; port SWD_CLK
SWD_DIO: P200.5 U200.37(PTA3) ; port SWD_DIO
TX_3G: U200.86(PTC14) ; port TX_3G
TX_UART0: P200.6 U200.63(PTB17) ; port TX_DBG_MCU
TX_ZB: U200.73(PTC3/LLWU_P7) ; port TX_ZB
VBAT_CTRL_E: U200.91(PTC17) ; port VBAT_CTRL_E
WAKE: U200.99(PTD6/LLWU_P15) U202.5(WAKE) ; port WAKE
XTAL0: R207.2 U200.51(PTA19)
NetBT201_1: BT201.1 R212.1
NetC204_2: C204.2 R206.2 U200.28(XTAL32) Y200.1
NetC205_1: C205.1 U200.26(VREF_OUT/CMP1_IN5/CMP0_IN5/ADC1_SE18)
NetC207_2: C207.2 R206.1 U200.29(EXTAL32) Y200.2
NetR202_2: R202.2 U200.12(VOUT33) U200.13(VREGIN)
NetR208_1: R208.1 STT.1(anot)
NetR210_2: R210.2 R211.2 U202.3(DELAY/M_RST)

Not connected (* = marked no-connect by the designer): U200 10(USB0_DP) 11(USB0_DM) 14(ADC0_DP1) 15(ADC0_DM1) 16(ADC1_DP1) 17(ADC1_DM1) 18(PGA0_DP/ADC0_DP0/ADC1_DP3) 19(PGA0_DM/ADC0_DM0/ADC1_DM3) 20(PGA1_DP/ADC1_DP0/ADC0_DP3) 21(PGA1_DM/ADC1_DM0/ADC0_DM3) 27(DAC0_OUT/CMP1_IN3/ADC0_SE23) 35(PTA1) 36(PTA2) 38(PTA4/LLWU_P3) 57(PTB9) 58(PTB10) 59(PTB11) 64(PTB18) 65(PTB19) 66(PTB20) 67(PTB21) 68(PTB22) 69(PTB23) 70(PTC0) 71(PTC1/LLWU_P6) 78(PTC6/LLWU_P10) 79(PTC7) 80(PTC8) 81(PTC9) 82(PTC10) 83(PTC11/LLWU_P11) 84(PTC12) 92(PTC18) 93(PTD0/LLWU_P12) 94(PTD1)

### Notes on the sheet
- (near C201) UART 4
- (near C206) UART 1
- SD CARD
- UART 0
- MCU
- BUTTON CONTROL
- PROGRAM
- UART DEBUG
- LED STATUS
- NANO TIMER
- RESET

### Library data of the parts
C10 C200-C203 C205 C206 C208-C213 = CAP0.1u0402: as C100 on sheet [03] POWER; Supplier 1: Digi-Key; RoHS: RoHS Compliant; Category: Capacitors; Stock 1: 23930; Pricing 1: 1=0.1, 10=0.05, 100=0.0223, 500=0.01594, 1000=0.01252, 2500=0.01138, 5000=0.01047 (USD); Packaging: Cut Tape (CT); Part Status: Active; Capacitance: 0.1µF; Voltage - Rated: 10V; Temperature Coefficient: X7R; Operating Temperature: -55°C ~ 125°C; Features: -; Ratings: AEC-Q200; Applications: Automotive; Mounting Type: Surface Mount, MLCC; Package / Case: 0402 (1005 Metric); Size / Dimension: 0.039" L x 0.020" W (1.00mm x 0.50mm); Height - Seated (Max): -; Thickness (Max): 0.022" (0.55mm); Lead Spacing: -; Lead Style: -; ComponentLink1URL: http://www.yuden.co.jp/productdata/catalog/en/mlcc_all_hq_e.pdf; ComponentLink1Description: http://www.yuden.co.jp/productdata/catalog/en/mlcc_all_hq_e.pdf; Supplier Part Number 1: 587-3769-1-ND
C204 C207 = CAP12p0402: CAP CER 12PF 50V NP0 0402; Manufacturer: Taiyo Yuden; Manufacturer Part Number: UMK105CG120JV-F; Tolerance: ±5%; Temperature Coefficient: C0G, NP0; Supplier 1: Digi-Key; RoHS: RoHS Compliant; Category: Capacitors; Stock 1: 104058; Pricing 1: 1=0.1, 10=0.025, 100=0.0112, 500=0.00796, 1000=0.00626, 2500=0.00569, 5000=0.00524 (USD); Packaging: Cut Tape (CT); Part Status: Active; Capacitance: 12pF; Voltage - Rated: 50V; Operating Temperature: -55°C ~ 125°C; Features: -; Ratings: -; Applications: General Purpose; Mounting Type: Surface Mount, MLCC; Package / Case: 0402 (1005 Metric); Size / Dimension: 0.039" L x 0.020" W (1.00mm x 0.50mm); Height - Seated (Max): -; Thickness (Max): 0.022" (0.55mm); Lead Spacing: -; Lead Style: -; ComponentLink1URL: http://ds.yuden.co.jp/TYCOMPAS/ut/detail.do?productNo=UMK105CG120JV-F&fileName=UMK105CG120JV-F_SS&mode=specSheetDownload; ComponentLink1Description: http://ds.yuden.co.jp/TYCOMPAS/ut/detail.do?productNo=UMK105CG120JV-F&fileName=UMK105CG120JV-F_SS&mode=specSheetDownload; Supplier Part Number 1: 587-1948-1-ND
P200 = Header 4X2: Header, 4-Pin, Dual row; LatestRevisionDate: 17-Jul-2002; LatestRevisionNote: Re-released for DXP Platform.; Publisher: Altium Limited
P201 = Header 11: Header, 11-Pin; LatestRevisionDate: 17-Jul-2002; LatestRevisionNote: Re-released for DXP Platform.; Publisher: Altium Limited
R200 R202 R209 = RES10k0603: RES SMD 10K OHM 1% 1/10W 0603; Manufacturer: Panasonic Electronic Components; Manufacturer Part Number: ERJ-3EKF1002V; Power (Watts): 0.1W, 1/10W; Temperature Coefficient: ±100ppm/°C; Supplier 1: Digi-Key; RoHS: RoHS Compliant; Category: Resistors; Stock 1: 0; Pricing 1: 1=0.1, 10=0.021, 100=0.0087, 1000=0.00389, 2500=0.00338 (USD); Packaging: Digi-Reel®; Part Status: Active; Resistance (Ohms): 10k; Tolerance: ±1%; Composition: Thick Film; Features: Automotive AEC-Q200; Operating Temperature: -55°C ~ 155°C; Package / Case: 0603 (1608 Metric); Supplier Device Package: 0603; Size / Dimension: 0.063" L x 0.031" W (1.60mm x 0.80mm); Height - Seated (Max): 0.022" (0.55mm); Failure Rate: -; ComponentLink1URL: https://industrial.panasonic.com/cdbs/www-data/pdf/RDA0000/AOA0000C298.pdf; ComponentLink1Description: https://industrial.panasonic.com/cdbs/www-data/pdf/RDA0000/AOA0000C298.pdf; Supplier Part Number 1: P10.0KHDKR-ND
R206 = RES1M0603: as R106 on sheet [03] POWER; Supplier 1: Digi-Key; RoHS: RoHS Compliant; Category: Resistors; Stock 1: 0; Pricing 1: 1=0.1, 10=0.021, 100=0.0087, 1000=0.00389, 2500=0.00338 (USD); Packaging: Cut Tape (CT); Part Status: Active; Resistance (Ohms): 1M; Tolerance: ±1%; Composition: Thick Film; Features: Automotive AEC-Q200; Operating Temperature: -55°C ~ 155°C; Package / Case: 0603 (1608 Metric); Supplier Device Package: 0603; Size / Dimension: 0.063" L x 0.031" W (1.60mm x 0.80mm); Height - Seated (Max): 0.022" (0.55mm); Failure Rate: -; ComponentLink1URL: https://industrial.panasonic.com/cdbs/www-data/pdf/RDA0000/AOA0000C298.pdf; ComponentLink1Description: https://industrial.panasonic.com/cdbs/www-data/pdf/RDA0000/AOA0000C298.pdf; Supplier Part Number 1: P1.00MHCT-ND
R207 R212 = RES00603: RES SMD 0.0OHM JUMPER 1/10W 0603; Manufacturer: Panasonic Electronic Components; Manufacturer Part Number: ERJ-3GEY0R00V; Power (Watts): 0.1W, 1/10W; Supplier 1: Digi-Key; RoHS: RoHS Compliant; Category: Resistors; Stock 1: 8597757; Pricing 1: 1=0.1, 10=0.016, 25=0.0116, 50=0.0088, 100=0.0065, 250=0.00496, 500=0.00396, 1000=0.00292 (USD); Packaging: Cut Tape (CT); Part Status: Active; Resistance (Ohms): 0.0; Tolerance: Jumper; Composition: Thick Film; Features: Automotive AEC-Q200; Temperature Coefficient: -; Operating Temperature: -55°C ~ 155°C; Package / Case: 0603 (1608 Metric); Supplier Device Package: 0603; Size / Dimension: 0.063" L x 0.031" W (1.60mm x 0.80mm); Height - Seated (Max): 0.022" (0.55mm); Failure Rate: -; ComponentLink1URL: http://industrial.panasonic.com/www-cgi/jvcr13pz.cgi?E+PZ+3+AOA0001+ERJ3GEY0R00V+7+WW; ComponentLink1Description: http://industrial.panasonic.com/www-cgi/jvcr13pz.cgi?E+PZ+3+AOA0001+ERJ3GEY0R00V+7+WW; Supplier Part Number 1: P0.0GCT-ND
R208 = RES1k0603: as R103 on sheet [03] POWER; Supplier 1: Digi-Key; RoHS: RoHS Compliant; Category: Resistors; Stock 1: 0; Pricing 1: 1=0.1, 10=0.021, 100=0.0087, 1000=0.00389, 2500=0.00338 (USD); Packaging: Digi-Reel®; Part Status: Active; Resistance (Ohms): 1k; Tolerance: ±1%; Composition: Thick Film; Features: Automotive AEC-Q200; Operating Temperature: -55°C ~ 155°C; Package / Case: 0603 (1608 Metric); Supplier Device Package: 0603; Size / Dimension: 0.063" L x 0.031" W (1.60mm x 0.80mm); Height - Seated (Max): 0.022" (0.55mm); Failure Rate: -; ComponentLink1URL: https://industrial.panasonic.com/cdbs/www-data/pdf/RDA0000/AOA0000C298.pdf; ComponentLink1Description: https://industrial.panasonic.com/cdbs/www-data/pdf/RDA0000/AOA0000C298.pdf; Supplier Part Number 1: P1.00KHDKR-ND
R210 = Resistor: RES SMD 187K OHM 1% 1/10W 0603; Manufacturer: Panasonic Electronic Components; Manufacturer Part Number: ERJ-3EKF1873V; Power (Watts): 0.1W, 1/10W; Temperature Coefficient: ±100ppm/°C; Supplier 1: Digi-Key; Supplier Part Number 1: P187KHCT-ND; RoHS: RoHS Compliant; Category: Resistors; Stock 1: 17711; Pricing 1: 1=0.1, 10=0.021, 100=0.0087, 1000=0.00389, 2500=0.00338 (USD); Packaging: Cut Tape (CT); Part Status: Active; Resistance (Ohms): 187k; Tolerance: ±1%; Composition: Thick Film; Features: Automotive AEC-Q200; Operating Temperature: -55°C ~ 155°C; Package / Case: 0603 (1608 Metric); Supplier Device Package: 0603; Size / Dimension: 0.063" L x 0.031" W (1.60mm x 0.80mm); Height - Seated (Max): 0.022" (0.55mm); Failure Rate: -; ComponentLink1URL: https://industrial.panasonic.com/cdbs/www-data/pdf/RDA0000/AOA0000C298.pdf; ComponentLink1Description: https://industrial.panasonic.com/cdbs/www-data/pdf/RDA0000/AOA0000C298.pdf
R211 = Resistor: RES SMD 182K OHM 1% 1/10W 0603; Manufacturer: Panasonic Electronic Components; Manufacturer Part Number: ERJ-3EKF1823V; Power (Watts): 0.1W, 1/10W; Temperature Coefficient: ±100ppm/°C; Supplier 1: Digi-Key; Supplier Part Number 1: P182KHCT-ND; RoHS: RoHS Compliant; Category: Resistors; Stock 1: 140068; Pricing 1: 1=0.1, 10=0.021, 100=0.0087, 1000=0.00389, 2500=0.00338 (USD); Packaging: Cut Tape (CT); Part Status: Active; Resistance (Ohms): 182k; Tolerance: ±1%; Composition: Thick Film; Features: Automotive AEC-Q200; Operating Temperature: -55°C ~ 155°C; Package / Case: 0603 (1608 Metric); Supplier Device Package: 0603; Size / Dimension: 0.063" L x 0.031" W (1.60mm x 0.80mm); Height - Seated (Max): 0.022" (0.55mm); Failure Rate: -; ComponentLink1URL: https://industrial.panasonic.com/cdbs/www-data/pdf/RDA0000/AOA0000C298.pdf; ComponentLink1Description: https://industrial.panasonic.com/cdbs/www-data/pdf/RDA0000/AOA0000C298.pdf
STT = LedGreen0603: LED GREEN CLEAR 0603 SMD; Manufacturer: Everlight Electronics Co Ltd; Manufacturer Part Number: QTLP601C4TR; Lens Color: Colorless; Millicandela Rating: 15mcd; Lens Style/Size: Rectangle with Flat Top, 1.20mm x 0.80mm; Voltage - Forward (Vf) (Typ): 2.1V; Current - Test: 20mA; Viewing Angle: 120°; Wavelength - Dominant: 570nm; Wavelength - Peak: 565nm; Supplier 1: Digi-Key; RoHS: RoHS Compliant; Category: Optoelectronics; Stock 1: 19080; Pricing 1: 1=0.51, 10=0.366, 25=0.2808, 100=0.1832, 250=0.13432, 500=0.11396, 1000=0.09361 (USD); Packaging: Cut Tape (CT); Part Status: Active; Color: Green; Lens Transparency: Clear; Mounting Type: Surface Mount; Features: -; Package / Case: 0603 (1608 Metric); Supplier Device Package: 0603; Size / Dimension: 1.60mm L x 0.80mm W; Height (Max): 0.60mm; ComponentLink1URL: http://media.digikey.com/pdf/Data%20Sheets/Everlight%20PDFs/QTLP601C-2,3,4,7,B.pdf; ComponentLink1Description: http://media.digikey.com/pdf/Data%20Sheets/Everlight%20PDFs/QTLP601C-2,3,4,7,B.pdf; Supplier Part Number 1: 1080-1405-1-ND
U200 = MK64FN1M0VLL12: IC MCU 32BIT 1MB FLASH 100LQFP; Manufacturer: NXP USA Inc.; Core Processor: ARM® Cortex®-M4; Core Size: 32-Bit; Speed: 120MHz; Connectivity: CAN, EBI/EMI, Ethernet, I²C, IrDA, SD, SPI, UART/USART, USB, USB OTG; Peripherals: DMA, I²S, LVD, POR, PWM, WDT; Number of I/O: 66; Program Memory Size: 1MB (1M x 8); RAM Size: 256K x 8; Voltage - Supply (Vcc/Vdd): 1.71 V ~ 3.6 V; Data Converters: A/D 32x16b, D/A 1x12b; Oscillator Type: Internal; Supplier 1: Digi-Key; Manufacturer Part Number: MK64FN1M0VLL12; RoHS: RoHS Compliant; Category: Integrated Circuits (ICs); Stock 1: 0; Pricing 1: 1=13, 10=11.947, 100=10.7003 (USD); Packaging: Tray; Part Status: Active; Program Memory Type: FLASH; EEPROM Size: -; Operating Temperature: -40°C ~ 105°C (TA); Package / Case: 100-LQFP; Supplier Device Package: 100-LQFP (14x14); ComponentLink1URL: http://cache.freescale.com/files/microcontrollers/doc/data_sheet/K64P144M120SF5.pdf; ComponentLink1Description: http://cache.freescale.com/files/microcontrollers/doc/data_sheet/K64P144M120SF5.pdf; Supplier Part Number 1: MK64FN1M0VLL12-ND
U202 = TPL5010: IC TIMER W/WATCHDOG 6SOT; Manufacturer: Texas Instruments; Manufacturer Part Number: TPL5010QDDCRQ1; Voltage - Supply: 1.8 V ~ 5 V; Current - Supply: 35nA; Supplier 1: Digi-Key; RoHS: RoHS Compliant; Category: Integrated Circuits (ICs); Stock 1: 2785; Pricing 1: 1=1.27, 10=1.136, 100=0.886, 500=0.73192, 1000=0.57783 (USD); Packaging: Cut Tape (CT); Part Status: Active; Type: Programmable Timer; Count: -; Frequency: -; Operating Temperature: -40°C ~ 125°C; Package / Case: SOT-23-6 Thin, TSOT-23-6; Supplier Device Package: TSOT-23-6; Mounting Type: Surface Mount; ComponentLink1URL: http://www.ti.com/lit/ds/symlink/tpl5010-q1.pdf; ComponentLink1Description: http://www.ti.com/lit/ds/symlink/tpl5010-q1.pdf; Supplier Part Number 1: 296-44963-1-ND
Y200 = CRYSTAL32.768: CRYSTAL 32.7680KHZ 12.5PF SMD; Manufacturer: Abracon LLC; Manufacturer Part Number: ABS07-32.768KHZ-T; Frequency Tolerance: ±20ppm; ESR (Equivalent Series Resistance): 70 kOhm; Operating Mode: Fundamental; Supplier 1: Digi-Key; RoHS: RoHS Compliant; Category: Crystals, Oscillators, Resonators; Stock 1: 409054; Pricing 1: 1=1.09, 10=0.961, 50=0.8988, 100=0.7942, 500=0.7524, 1000=0.627 (USD); Packaging: Digi-Reel®; Part Status: Active; Type: kHz Crystal (Tuning Fork); Frequency: 32.768kHz; Frequency Stability: -; Load Capacitance: 12.5pF; Operating Temperature: -40°C ~ 85°C; Ratings: -; Mounting Type: Surface Mount; Package / Case: 2-SMD, No Lead; Size / Dimension: 0.126" L x 0.061" W (3.20mm x 1.50mm); Height - Seated (Max): 0.035" (0.90mm); ComponentLink1URL: http://www.abracon.com/Resonators/ABS07.pdf; ComponentLink1Description: http://www.abracon.com/Resonators/ABS07.pdf; Supplier Part Number 1: 535-9542-6-ND